# Altium schematic sheet LED-PCB_Master.SchDoc
size B; SheetNumber: 1; SheetTotal: 1
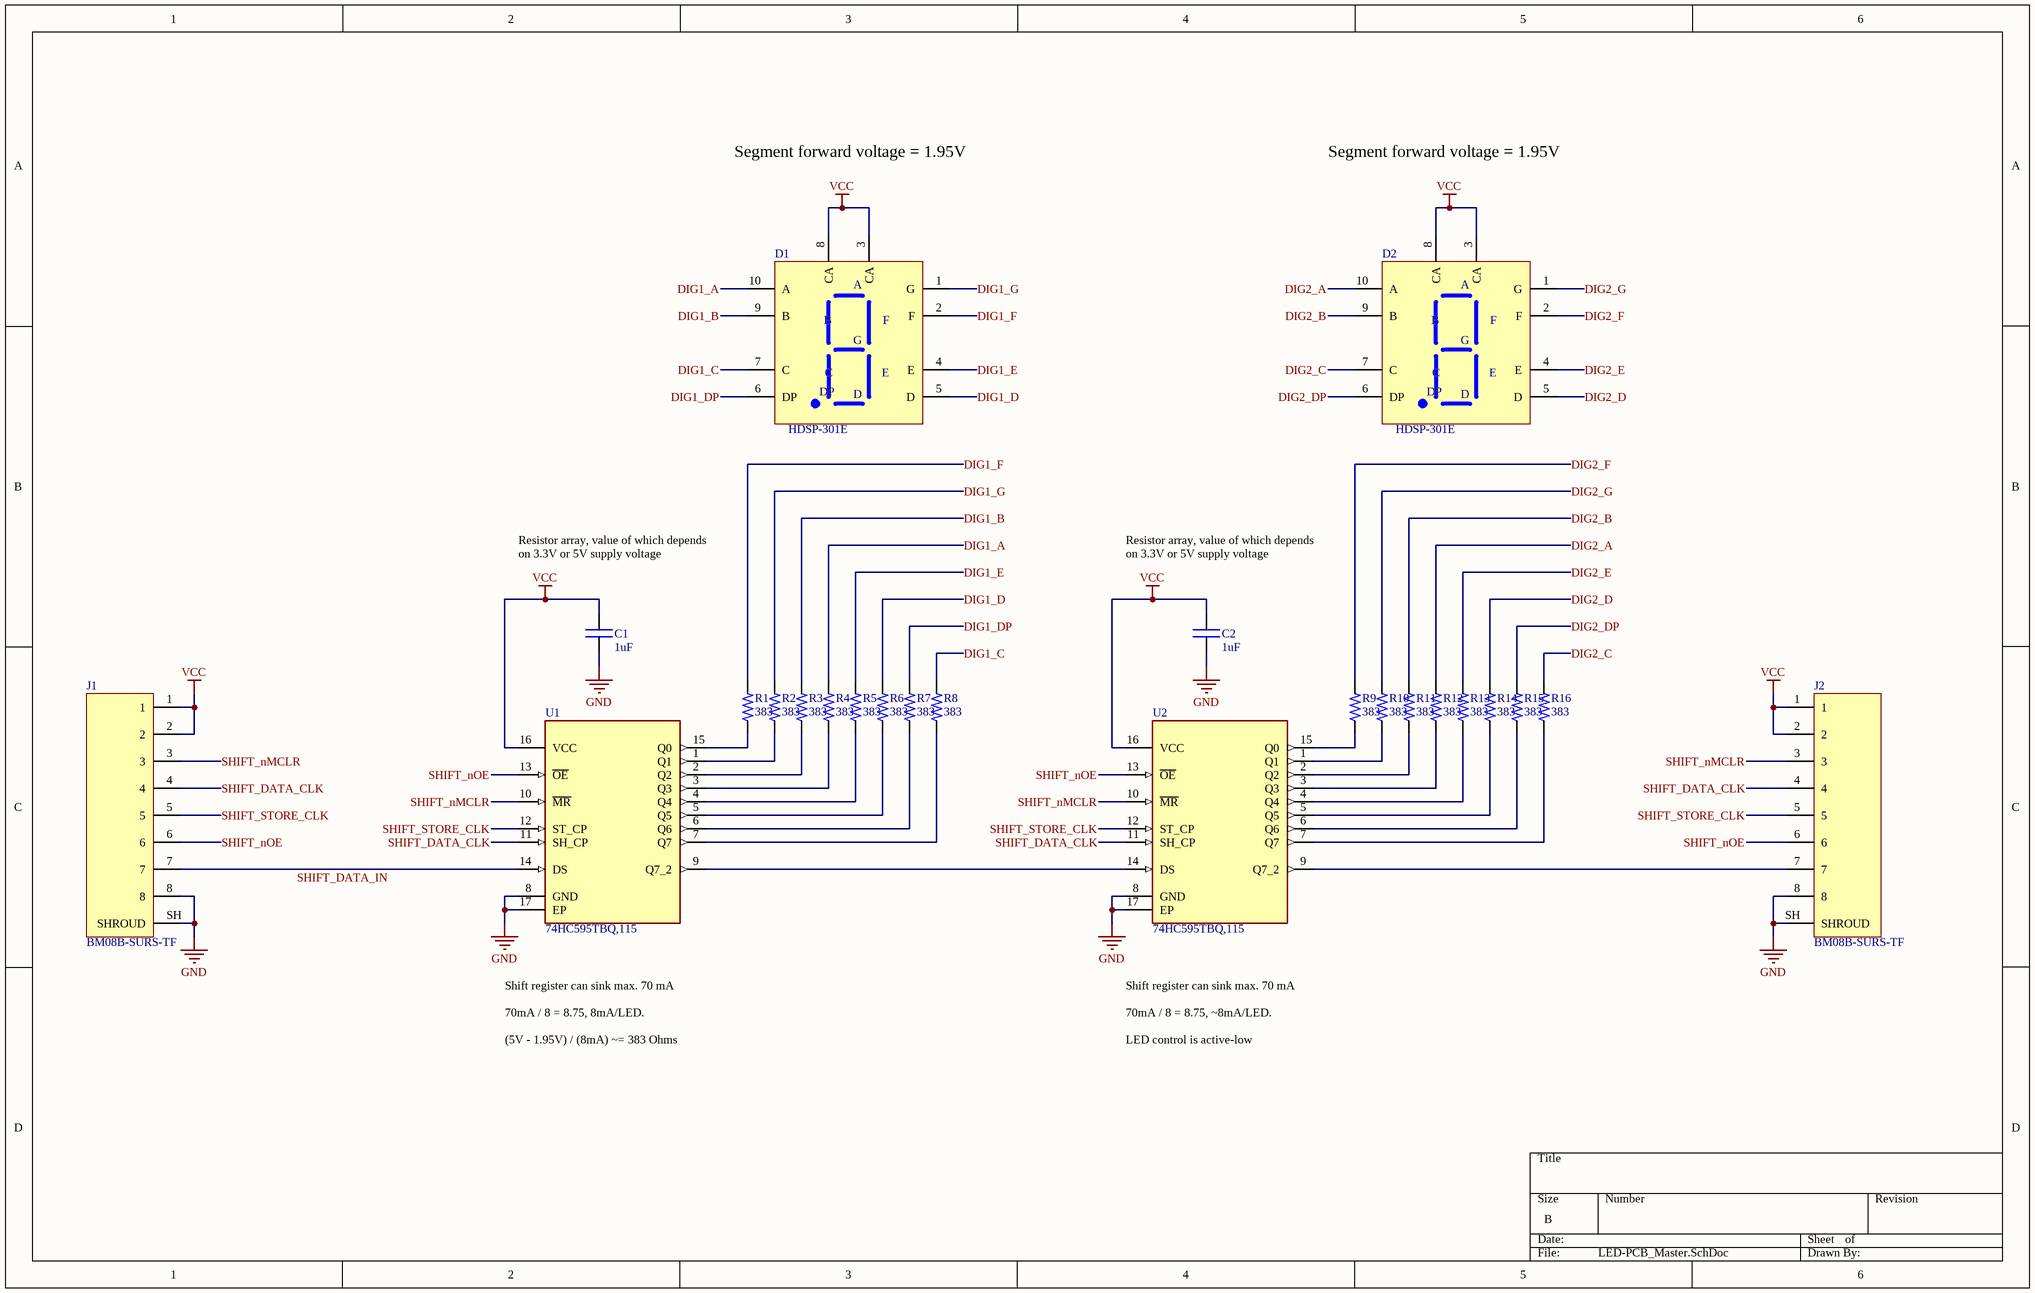
[diagram p0: LED-PCB_Master.SchDoc]

## Parts
C1  value 1uF  [0402C]  (hidden comment: CAP)
C2  value 1uF  [0402C]  (hidden comment: CAP)
D1  HDSP-301E  [10-DIP_7SEG]
D2  HDSP-301E  [10-DIP_7SEG]
J1  BM08B-SURS-TF  [JST_BM08B-SURS-TF(LF)(SN)]
J2  BM08B-SURS-TF  [JST_BM08B-SURS-TF(LF)(SN)]
R1  value 383  [0402R]  (hidden comment: RES)
R2  value 383  [0402R]  (hidden comment: RES)
R3  value 383  [0402R]  (hidden comment: RES)
R4  value 383  [0402R]  (hidden comment: RES)
R5  value 383  [0402R]  (hidden comment: RES)
R6  value 383  [0402R]  (hidden comment: RES)
R7  value 383  [0402R]  (hidden comment: RES)
R8  value 383  [0402R]  (hidden comment: RES)
R9  value 383  [0402R]  (hidden comment: RES)
R10  value 383  [0402R]  (hidden comment: RES)
R11  value 383  [0402R]  (hidden comment: RES)
R12  value 383  [0402R]  (hidden comment: RES)
R13  value 383  [0402R]  (hidden comment: RES)
R14  value 383  [0402R]  (hidden comment: RES)
R15  value 383  [0402R]  (hidden comment: RES)
R16  value 383  [0402R]  (hidden comment: RES)
U1  74HC595TBQ,115  [16-VFQN-EP]
U2  74HC595TBQ,115  [16-VFQN-EP]

## Nets
GND: C1.2 C2.2 J1.8 J1.SH(SHROUD) J2.8 J2.SH(SHROUD) U1.8(GND) U1.17(EP) U2.8(GND) U2.17(EP)
VCC: C1.1 C2.1 D1.3(CA) D1.8(CA) D2.3(CA) D2.8(CA) J1.1 J1.2 J2.1 J2.2 U1.16(VCC) U2.16(VCC)
DIG1_A: D1.10(A) R4.2
DIG1_B: D1.9(B) R3.2
DIG1_C: D1.7(C) R8.2
DIG1_D: D1.5(D) R6.2
DIG1_DP: D1.6(DP) R7.2
DIG1_E: D1.4(E) R5.2
DIG1_F: D1.2(F) R1.2
DIG1_G: D1.1(G) R2.2
DIG2_A: D2.10(A) R12.2
DIG2_B: D2.9(B) R11.2
DIG2_C: D2.7(C) R16.2
DIG2_D: D2.5(D) R14.2
DIG2_DP: D2.6(DP) R15.2
DIG2_E: D2.4(E) R13.2
DIG2_F: D2.2(F) R9.2
DIG2_G: D2.1(G) R10.2
SHIFT_DATA_CLK: J1.4 J2.4 U1.11(SH_CP) U2.11(SH_CP)
SHIFT_DATA_IN: J1.7 U1.14(DS)
SHIFT_nMCLR: J1.3 J2.3 U1.10(~{MR}) U2.10(~{MR})
SHIFT_nOE: J1.6 J2.6 U1.13(~{OE}) U2.13(~{OE})
SHIFT_STORE_CLK: J1.5 J2.5 U1.12(ST_CP) U2.12(ST_CP)
NetJ2_7: J2.7 U2.9(Q7_2)
NetR1_1: R1.1 U1.15(Q0)
NetR2_1: R2.1 U1.1(Q1)
NetR3_1: R3.1 U1.2(Q2)
NetR4_1: R4.1 U1.3(Q3)
NetR5_1: R5.1 U1.4(Q4)
NetR6_1: R6.1 U1.5(Q5)
NetR7_1: R7.1 U1.6(Q6)
NetR8_1: R8.1 U1.7(Q7)
NetR9_1: R9.1 U2.15(Q0)
NetR10_1: R10.1 U2.1(Q1)
NetR11_1: R11.1 U2.2(Q2)
NetR12_1: R12.1 U2.3(Q3)
NetR13_1: R13.1 U2.4(Q4)
NetR14_1: R14.1 U2.5(Q5)
NetR15_1: R15.1 U2.6(Q6)
NetR16_1: R16.1 U2.7(Q7)
NetU1_9: U1.9(Q7_2) U2.14(DS)

## Notes on the sheet
- Segment forward voltage = 1.95V
- Resistor array, value of which depends on 3.3V or 5V supply voltage
- Shift register can sink max. 70 mA
  70mA / 8 = 8.75, 8mA/LED.
  (5V - 1.95V) / (8mA) ~= 383 Ohms
  LED control is active-low
- Shift register can sink max. 70 mA
  70mA / 8 = 8.75, ~8mA/LED.
  LED control is active-low

## Library data of the parts
C1 C2 = CAP: Capacitor; MFR: Murata Electronics; MFR PN: GRM155R61E105MA12D; Type: SMD; Vendor: *; Vendor PN: *; Vendor Link: *
D1 D2 = 7SEG SINGLE TH: DISPLAY 7-SEG 0.4" SGL RED 10DIP; MFR: Broadcom Limited; Type: TH; MFR PN: HDSP-301E
J1 J2 = CONN 8POS 0.8MM PITCH: CONN HEADER SMD 8POS 0.8MM; MFR: JST; MFR PN: BM08B-SURS-TF; Type: SMD
R1-R16 = RES: Resistor; MFR PN: RC0402FR-07383RL; MFR: YAGEO; Vendor: *; Vendor PN: *; Vendor Link: *; Type: SMD
U1 U2 = SHIFT REG 8BIT QFN: IC 8BIT SHIFT REGISTER 16-DHVQFN; MFR: Nexperia USA Inc.; MFR PN: 74HCT595BQ,115; Type: SMD; Package: QFN